# EasyEDA Pro project stm32可编程多功能手表 (1).epro

# Schematic Schematic1
Board Name: Board1; Create Date: 2025-06-26; Page Name: P1; Project Name: stm32可编程多功能手表; Schematic Name: Schematic1; Update Date: 2025-06-28; Company: 嘉立创EDA; Page Size: A4; Version: V1.0
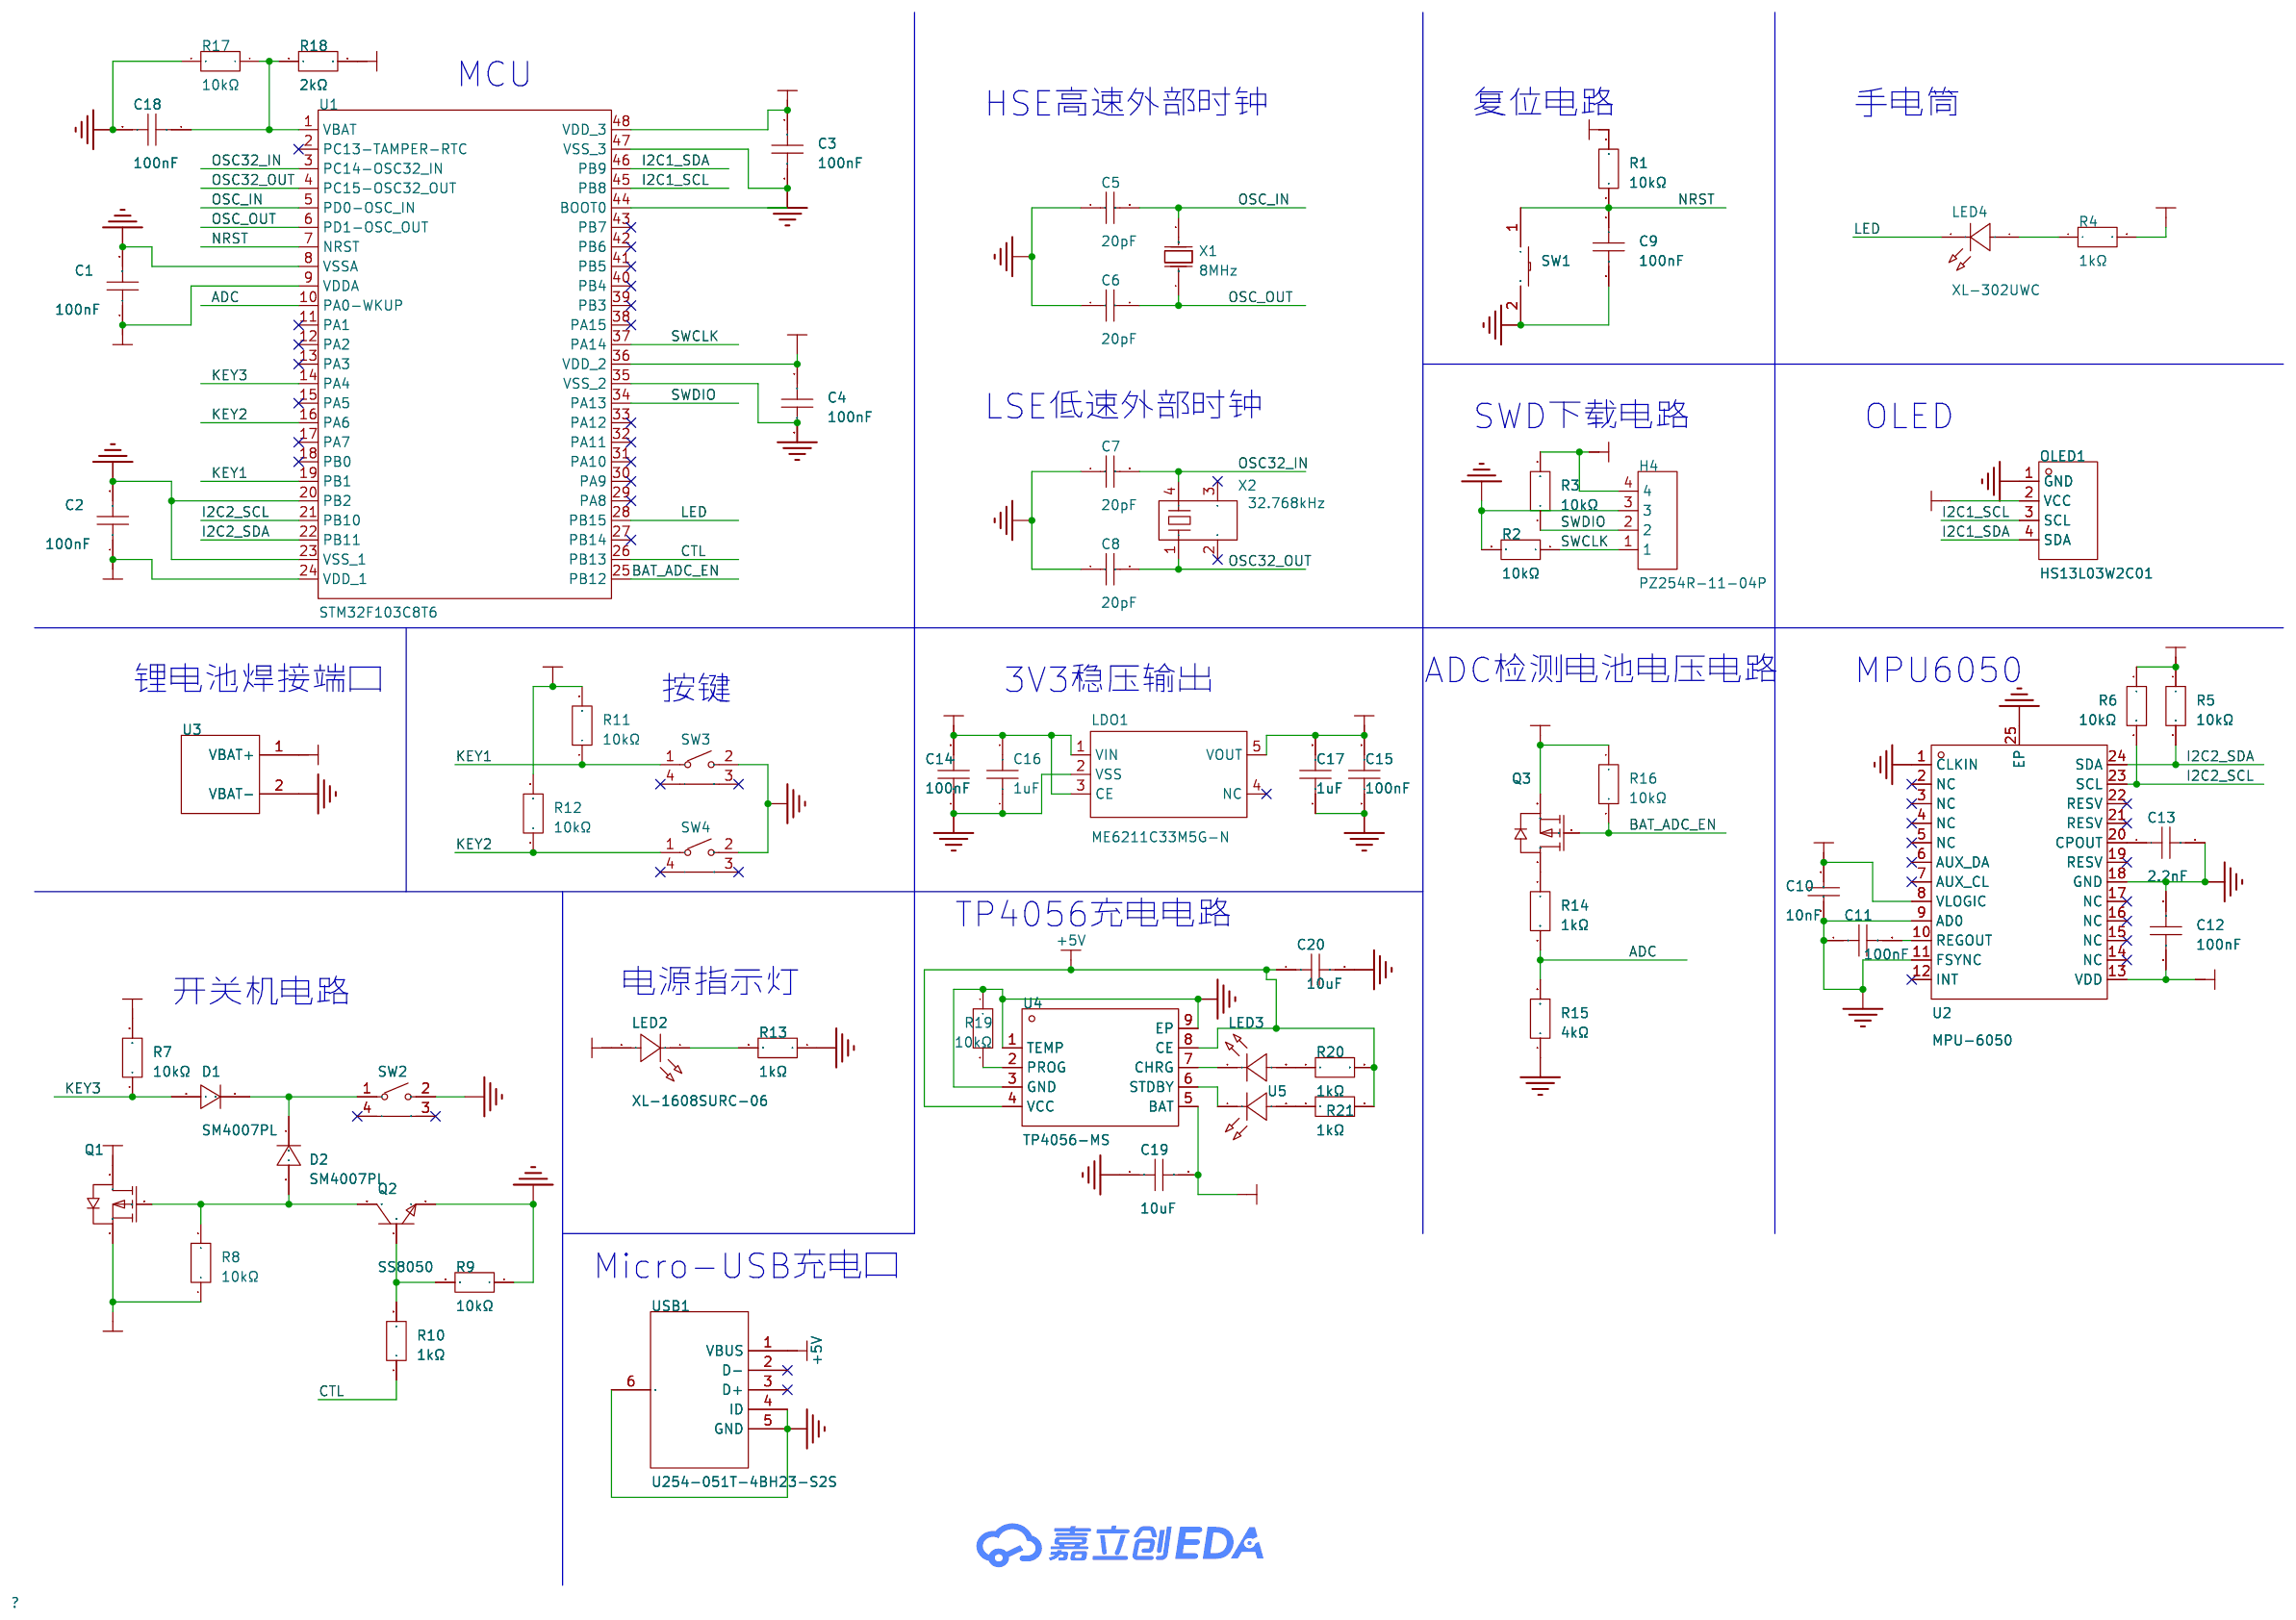
[diagram p0: schematic sheet]

## Parts
C1  100nF  [C0603]
C2  100nF  [C0603]
C3  100nF  [C0603]
C4  100nF  [C0603]
C5  20pF  [C0603]
C6  20pF  [C0603]
C7  20pF  [C0603]
C8  20pF  [C0603]
C9  100nF  [C0603]
C10  10nF  [C0603]
C11  100nF  [C0603]
C12  100nF  [C0603]
C13  2.2nF  [C0603]
C14  100nF  [C0603]
C15  100nF  [C0603]
C16  1uF  [C0603]
C17  1uF  [C0603]
C18  100nF  [C0603]
C19  10uF  [C0603]
C20  10uF  [C0603]
D1  SM4007PL  [SOD-123F_L2.8-W1.8-LS3.7-RD]
D2  SM4007PL  [SOD-123F_L2.8-W1.8-LS3.7-RD]
H4  PZ254R-11-04P  [HDR-TH_4P-P2.54-H-M-W10.4]
LDO1  ME6211C33M5G-N  [SOT-23-5_L3.0-W1.7-P0.95-LS2.8-BL]
LED2  XL-1608SURC-06  [LED0603-RD_RED]
LED3  XL-1608SURC-06  [LED0603-RD_RED]
LED4  XL-302UWC  [LED-TH_BD3.8-P2.54-FD_WHITE]
OLED1  HS13L03W2C01  [OLED-TH_L35.4-W33.5_HS13L03W2C01]
Q1  SI2301CDS-T1-GE3  [SOT-23-3_L3.0-W1.7-P0.95-LS2.9-BR]
Q2  SS8050  [SOT-23-3_L2.9-W1.3-P1.90-LS2.4-BR]
Q3  SI2301CDS-T1-GE3  [SOT-23-3_L3.0-W1.7-P0.95-LS2.9-BR]
R1  10kΩ  [R0603]
R2  10kΩ  [R0603]
R3  10kΩ  [R0603]
R4  1kΩ  [R0603]
R5  10kΩ  [R0603]
R6  10kΩ  [R0603]
R7  10kΩ  [R0603]
R8  10kΩ  [R0603]
R9  10kΩ  [R0603]
R10  1kΩ  [R0603]
R11  10kΩ  [R0603]
R12  10kΩ  [R0603]
R13  1kΩ  [R0603]
R14  1kΩ  [R0603]
R15  4kΩ  [R0603]
R16  10kΩ  [R0603]
R17  10kΩ  [R0603]
R18  2kΩ  [R0603]
R19  10kΩ  [R0603]
R20  1kΩ  [R0603]
R21  1kΩ  [R0603]
SW1  TS-1101-C-W  [SW-SMD_L6.0-W3.3-LS8.0]
SW2  GT-TC018A-H0375-L1  [SW-SMD_L4.7-W3.5-P3.35-EH]
SW3  GT-TC018A-H0375-L1  [SW-SMD_L4.7-W3.5-P3.35-EH]
SW4  GT-TC018A-H0375-L1  [SW-SMD_L4.7-W3.5-P3.35-EH]
U1  STM32F103C8T6  [LQFP-48_L7.0-W7.0-P0.50-LS9.0-BL]
U2  MPU-6050  [QFN-24_L4.0-W4.0-P0.50-BL-EP2.7]
U3  -  [302530BAT]
U4  TP4056-MS  [SOP-8_L4.9-W3.9-P1.27-LS6.0-TL-EP]
U5  XL-1608PGC-06  [LED0603-RD_GREEN]
USB1  U254-051T-4BH23-S2S  [MICRO-USB-SMD_U254-051T-4BH23-S2S]
X1  8MHz  [CRYSTAL-SMD_L5.0-W3.2]
X2  32.768kHz  [MC-306_4P-L8.0-W3.2-P5.5-BL]

## Library data of the parts
C1-C4 C9 C11 C12 C14 C15 C18 = CC0603KRX7R9BB104: 容值:100nF;精度:±10%;额定电压:50V;温度系数:X7R;; LCSC Part Name: 100nF ±10% 50V; Supplier Part: C14663; Manufacturer: YAGEO(国巨); Supplier Footprint: 0603; JLCPCB Part Class: 基础库; Datasheet: https://atta.szlcsc.com/upload/public/pdf/source/20180910/C282072_33301C7F631E79921B82A8DAC6BCC5B3.pdf; Supplier: LCSC; Tolerance: ±10%; Voltage Rating: 50V; Temperature Coefficient: X7R
C5-C8 = CL10C200JB8NNNC: 容值:20pF;精度:±5%;额定电压:50V;材质(温度系数):C0G;; LCSC Part Name: 20pF ±5% 50V; Supplier Part: C1648; Manufacturer: SAMSUNG(三星); Supplier Footprint: 0603; JLCPCB Part Class: 基础库; Datasheet: https://atta.szlcsc.com/upload/public/pdf/source/20160218/1457707763339.pdf; Supplier: LCSC; Tolerance: ±5%; Voltage Rated: 50V; Temperature Coefficient: C0G
C10 = CC0603KRX7R9BB103: 容值:10nF;精度:±10%;额定电压:50V;材质(温度系数):X7R;; LCSC Part Name: 10nF ±10% 50V; Supplier Part: C100042; Manufacturer: YAGEO(国巨); Supplier Footprint: 0603; JLCPCB Part Class: 扩展库; Datasheet: https://atta.szlcsc.com/upload/public/pdf/source/20181008/C309510_22F155564471FAF6A489F7D68F34234E.pdf; Supplier: LCSC; Tolerance: ±10%; Voltage Rated: 50V; Temperature Coefficient: X7R
C13 = FCC0603B222K500CT: 容值:2.2nF;精度:±10%;额定电压:50V;温度系数:X7R;; LCSC Part Name: 2.2nF ±10% 50V; Supplier Part: C5137562; Manufacturer: FOJAN(富捷); Supplier Footprint: 0603; JLCPCB Part Class: 扩展库; Datasheet: https://atta.szlcsc.com/upload/public/pdf/source/20220818/0EB3B7FB2F5648AC16609637FBA7DABE.pdf; Supplier: LCSC; Tolerance: ±10%; Voltage Rating: 50V; Temperature Coefficient: X7R
C16 C17 = CL10A105KB8NNNC: 容值:1uF;精度:±10%;额定电压:50V;材质(温度系数):X5R;; LCSC Part Name: 1uF ±10% 50V; Supplier Part: C15849; Manufacturer: SAMSUNG(三星); Supplier Footprint: 0603; JLCPCB Part Class: 基础库; Datasheet: https://atta.szlcsc.com/upload/public/pdf/source/20160218/1457707763339.pdf; Supplier: LCSC; Tolerance: ±10%; Voltage Rated: 50V; Temperature Coefficient: X5R
C19 C20 = CL10A106KP8NNNC: 容值:10uF;精度:±10%;额定电压:10V;材质(温度系数):X5R;; LCSC Part Name: 10uF ±10% 10V; Supplier Part: C19702; Manufacturer: SAMSUNG(三星); Supplier Footprint: 0603; JLCPCB Part Class: 基础库; Datasheet: https://atta.szlcsc.com/upload/public/pdf/source/20160218/1457707763339.pdf; Supplier: LCSC; Tolerance: ±10%; Voltage Rated: 10V; Temperature Coefficient: X5R
D1 D2 = SM4007PL_C64898: 二极管配置:独立式;正向压降(Vf):1.1V@1A;直流反向耐压(Vr):1kV;整流电流:1A;; Supplier Part: C64898; Manufacturer: MDD(辰达半导体); Supplier Footprint: SOD-123FL; JLCPCB Part Class: 基础库; Datasheet: https://atta.szlcsc.com/upload/public/pdf/source/20241121/400BA5297D1B92A42708AD93AB64CE21.pdf; Supplier: LCSC; Diode Configuration: 独立式; Voltage - Forward(Vf@If): 1.1V@1A; Voltage - DC Reverse(Vr): 1kV; Current - Rectified: 1A; Reverse Leakage Current (Ir): 10uA@1kV
H4 = PZ254R-11-04P: 插针结构:1x4P;间距:2.54mm;行距:-;圆针/方针:方针;安装方式:弯插;排数:单排;总PIN位数:4P;额定电流:-;额定电压:-;配合针长度:6mm;塑高:2.5mm;触头材质:黄铜;触头镀层:-;工作温度:-40℃~+105℃;颜色:黑色;; LCSC Part Name: 1x4P 间距:2.54mm 方针 弯插; Supplier Part: C492412; Manufacturer: XFCN(兴飞); Supplier Footprint: 弯插,P=2.54mm; JLCPCB Part Class: 扩展库; Datasheet: https://atta.szlcsc.com/upload/public/pdf/source/20200309/C492412_B0EFFC1946AB079B8871416C4A09EF6C.pdf; Supplier: LCSC; Pin Structure: 1x4P; Pitch: 2.54mm; Circluar Pins/Square Pins: 方针; Mounting Type: 弯插; Number of Rows: 单排; Number of Pins: 4P; Length of Mating Pin: 6mm; Insulation Height: 2.5mm; Contact Material: 黄铜; Operating Temperature: -40℃~+105℃; Color: 黑色
LDO1 = ME6211C33M5G-N: 输出类型:固定;工作电压:6V;输出电压:3.3V;输出电流:500mA;电源纹波抑制比(PSRR):70dB@(1kHz)；62dB@(10kHz);输出极性:正极;; LCSC Part Name: 输入6V 输出3.3V 500mA; Supplier Part: C82942; Manufacturer: MICRONE(南京微盟); Supplier Footprint: SOT-23-5; JLCPCB Part Class: 扩展库; Datasheet: https://atta.szlcsc.com/upload/public/pdf/source/20170918/C82942_1505727073070976520.pdf; Supplier: LCSC; Output Type: 固定; Voltage - Supply: 6V; Output Voltage: 3.3V; Output Current: 500mA; Power Supply Rejection Ratio (PSRR): 70dB@(1kHz)；62dB@(10kHz); Voltage Dropout: 260mV@(200mA); Features: 短路保护(SCP)；低ESR；过流保护(OCP)；带使能; Output Configuration: 正极; Number of Outputs: 1
LED2 LED3 = XL-1608SURC-06: 灯头类型:-;发光颜色:红色;正向压降(Vf):2.3V;功率:50mW;正向电流:20mA;波长:620nm~630nm;二极管配置:-;透镜颜色:无色透明透镜;色温:-;发光强度:225mcd;发光角度:120°;载带方式:正贴;工作温度:-20℃~+85℃;; Supplier Part: C965799; Manufacturer: XINGLIGHT(成兴光); Supplier Footprint: 0603; JLCPCB Part Class: 扩展库; Datasheet: https://atta.szlcsc.com/upload/public/pdf/source/20250213/F9766CE804AF391355DCDD48DB3E0DAB.pdf; Supplier: LCSC; Illumination Color: 红色; Voltage - Forward(Vf): 2.3V; Power(Watts): 50mW; Forward Current: 20mA; Wavelength - Dominant: 620nm~630nm; Peak Wavelength: 625nm; Lens Color: 无色透明透镜; Luminous Intensity: 225mcd; Viewing Angle: 120°; Mounting Sytle: 正贴; Operating Temperature: -20℃~+85℃
LED4 = XL-302UWC: 灯头类型:3mm圆形灯头;发光颜色:白色;正向压降(Vf):3.2V;功率:70mW;正向电流:20mA;透镜颜色:无色透明透镜;色温:6000K~8000K;发光强度:8000mcd;发光角度:30°;载带方式:-;工作温度:-20℃~+85℃;; Supplier Part: C2895458; Manufacturer: XINGLIGHT(成兴光); Supplier Footprint: 插件,D=3mm; JLCPCB Part Class: 扩展库; Datasheet: https://atta.szlcsc.com/upload/public/pdf/source/20240112/543BCCAC3CB93518E6AD22EB07A95060.pdf; Supplier: LCSC; Lamp Holder Type: 3mm圆形灯头; Illumination Color: 白色; Voltage - Forward(Vf): 3.2V; Power(Watts): 70mW; Forward Current: 20mA; Lens Color: 无色透明透镜; Color Temperature: 6000K~8000K; Luminous Intensity: 8000mcd; Viewing Angle: 30°; Operating Temperature: -20℃~+85℃
OLED1 = HS13L03W2C01: 主控芯片:SH1106;接口类型:I2C;尺寸(inch):1.3;; LCSC Part Name: 1.3'1.3寸 128*64 OLED显示屏 I2C通讯 SH1106 白光; Supplier Part: C7465997; Manufacturer: HS(汉昇); JLCPCB Part Class: 扩展库; Datasheet: https://atta.szlcsc.com/upload/public/pdf/source/20230720/8731A47396DED074CDCD72E9ACEFB46F.pdf; Supplier: LCSC; Main Control Chip: SH1106; Interface Type: I2C; Size: 1.3; Operating Temperature: -40℃~+70℃
Q1 Q3 = SI2301CDS-T1-GE3: 数量:1个P沟道;漏源电压(Vdss):20V;连续漏极电流(Id):2.3A;导通电阻(RDS(on)):112mΩ@4.5V,2.8A;耗散功率(Pd):860mW;阈值电压(Vgs(th)):1V;; LCSC Part Name: 1个P沟道 耐压:20V 电流:2.3A; Supplier Part: C10487; Manufacturer: VISHAY(威世); Supplier Footprint: SOT-23; JLCPCB Part Class: 基础库; Datasheet: https://atta.szlcsc.com/upload/public/pdf/source/20180621/C10487_757133A2CC00440C4C7DD3E7E73681E9.pdf; Supplier: LCSC; Number: 1个P沟道; Drain to Source Voltage: 20V; Current - Continuous Drain(Id): 2.3A; RDS(on): 112mΩ@4.5V,2.8A; Pd - Power Dissipation: 860mW; Gate Threshold Voltage (Vgs(th)@Id): 1V; Gate Charge(Qg): 3.3nC@10V; Input Capacitance(Ciss@Vds): 405pF@10V; Reverse Transfer Capacitance (Crss@Vds): 55pF@10V; Operating Temperature: -55℃~+150℃
Q2 = SS8050_C7420370: 晶体管类型:NPN;集电极电流(Ic):1.5A;集射极击穿电压(Vceo):25V;耗散功率(Pd):300mW;直流电流增益(hFE):120@100mA,1.0V;; LCSC Part Name: H档 200-350; Supplier Part: C7420370; Manufacturer: 宏嘉诚; Supplier Footprint: SOT-23; Datasheet: https://atta.szlcsc.com/upload/public/pdf/source/20250205/5DB94E86981B5B1A1866D18E379C0D4F.pdf; Supplier: LCSC; type: NPN; Current - Collector(Ic): 1.5A; Collector - Emitter Voltage VCEO: 25V; Pd - Power Dissipation: 300mW; DC Current Gain: 120@100mA,1.0V; Transition frequency(fT): 100MHz; Current - Collector Cutoff: 100nA; Vce Saturation(VCE(sat)): 500mV; Operating Temperature: -55℃~+150℃
R1-R3 R5-R9 R11 R12 R16 R17 R19 = FRC0603J103 TS: 电阻类型:厚膜电阻;阻值:10kΩ;精度:±5%;功率:100mW;工作电压:75V;温度系数:±100ppm/℃;; LCSC Part Name: 10kΩ ±5% 100mW 厚膜电阻; Supplier Part: C2930027; Manufacturer: FOJAN(富捷); Supplier Footprint: 0603; JLCPCB Part Class: 扩展库; Datasheet: https://atta.szlcsc.com/upload/public/pdf/source/20211221/925EC7D7225764EE0046F22065062C87.pdf; Supplier: LCSC; Type: 厚膜电阻; Tolerance: ±5%; Power(Watts): 100mW; Voltage-Supply(Max): 75V; Temperature Coefficient: ±100ppm/℃; Operating Temperature: -55℃~+155℃
R4 R10 R13 R14 R20 R21 = FRC0603F1001TS: 电阻类型:厚膜电阻;阻值:1kΩ;精度:±1%;功率:100mW;最大工作电压:75V;温度系数:±100ppm/℃;; LCSC Part Name: 1kΩ ±1% 100mW 厚膜电阻; Supplier Part: C2907002; Manufacturer: FOJAN(富捷); Supplier Footprint: 0603; JLCPCB Part Class: 扩展库; Datasheet: https://atta.szlcsc.com/upload/public/pdf/source/20211221/925EC7D7225764EE0046F22065062C87.pdf; Supplier: LCSC; Type: 厚膜电阻; Tolerance: ±1%; Power(Watts): 100mW; Overload Voltage (Max): 75V; Temperature Coefficient: ±100ppm/℃; Operating Temperature Range: -55℃~+155℃
R15 = ARG03FTC4001N: 电阻类型:薄膜电阻;阻值:4kΩ;精度:±1%;; LCSC Part Name: 4kΩ ±1%; Supplier Part: C2984443; Manufacturer: Viking(光颉); Supplier Footprint: 0603; JLCPCB Part Class: 扩展库; Datasheet: https://atta.szlcsc.com/upload/public/pdf/source/20200117/C485675_99063924B4564AF910B7BE66DA8EFA49.pdf; Supplier: LCSC; Type: 薄膜电阻; Tolerance: ±1%
R18 = FRC0603J202 TS: 电阻类型:厚膜电阻;阻值:2kΩ;精度:±5%;功率:100mW;最大工作电压:75V;温度系数:±100ppm/℃;; LCSC Part Name: 2kΩ ±5% 100mW 厚膜电阻; Supplier Part: C2907137; Manufacturer: FOJAN(富捷); Supplier Footprint: 0603; Datasheet: https://atta.szlcsc.com/upload/public/pdf/source/20211221/925EC7D7225764EE0046F22065062C87.pdf; Supplier: LCSC; Type: 厚膜电阻; Tolerance: ±5%; Power(Watts): 100mW; Overload Voltage (Max): 75V; Temperature Coefficient: ±100ppm/℃; Operating Temperature Range: -55℃~+155℃
SW1 = TS-1101-C-W: 电路结构:单刀单掷;按钮形状:矩形按钮;作用力:260gf;安装方式:立贴;开关长度:6mm;开关宽度:3.6mm;开关高度:2.5mm;带支架:不带;触点电流:50mA;额定电压(AC):-;额定电压(DC):12V;额定功率:-;绝缘电阻:-;带灯:无;机械寿命:5万次;; LCSC Part Name: 6*3.6*2.5mm 立贴 轻触开关; Supplier Part: C318938; Manufacturer: XKB Connectivity(中国星坤); Supplier Footprint: SMD; JLCPCB Part Class: 扩展库; Datasheet: https://atta.szlcsc.com/upload/public/pdf/source/20200227/C318938_C2E53B1EEDE37D980A33616AC086DE53.pdf; Supplier: LCSC; Circuit: 单刀单掷; Actuator Style: 矩形按钮; Operating Force: 260gf; Mounting Style: 立贴; Switch Length: 6mm; Switch Width: 3.6mm; Switch Height: 2.5mm; Strike Gundam: 不带; Contact Current: 50mA; Voltage Rating (DC): 12V; Actuator/Cap Color: 白色带淡绿; With Lamp: 无; Mechanical Life: 5万次; Operating Temperature: -30℃~+85℃
SW2-SW4 = GT-TC018A-H0375-L1: 电路结构:单刀单掷;按钮形状:矩形按钮;作用力:1.6N;安装方式:卧贴;开关长度:4.7mm;开关宽度:1.9mm;开关高度:3.75mm;带支架:不带;触点电流:50mA;额定电压(DC):12V;绝缘电阻:100MΩ;带灯:无;机械寿命:10万次;; LCSC Part Name: 4.7*1.9*3.75mm 卧贴 轻触开关; Supplier Part: C963235; Manufacturer: G-Switch(品赞); Supplier Footprint: SMD; Datasheet: https://atta.szlcsc.com/upload/public/pdf/source/20201201/C963235_1379E8FB9A9D5A830B16F6A18B8D18DC.pdf; Supplier: LCSC; Circuit: 单刀单掷; Actuator Style: 矩形按钮; Operating Force: 1.6N; Mounting Style: 卧贴; Switch Length: 4.7mm; Switch Width: 1.9mm; Switch Height: 3.75mm; Strike Gundam: 不带; Contact Current: 50mA; Voltage Rating (DC): 12V; Insulation Resistance: 100MΩ; Actuator/Cap Color: 黑色; With Lamp: 无; Pin Style: SMD接片; Mechanical Life: 10万次; Operating Temperature: -30℃~+85℃
U1 = STM32F103C8T6: CPU内核:ARM-M3;CPU最大主频:72MHz;应用领域:-;; LCSC Part Name: 主流增强型ARM Cortex-M3 MCU，具有64 KB Flash、72 MHz CPU、电机控制、USB和CAN; Supplier Part: C8734; Manufacturer: ST(意法半导体); Supplier Footprint: LQFP-48(7x7); JLCPCB Part Class: 扩展库; Datasheet: https://atta.szlcsc.com/upload/public/pdf/source/20220812/8363ACEC51AD55ECEB84799464F7CB85.pdf; Supplier: LCSC; CPU Core: ARM-M3; CPU Maximum Speed: 72MHz; Program Storage Size: 64KB; Program Memory Type: FLASH; Number of I/O: 37; ADC (Bit): 12bit; Voltage - Supply: 2V~3.6V
U2 = MPU-6050: 传感器类型:加速度计陀螺仪;; Supplier Part: C24112; Manufacturer: TDK InvenSense(应美盛); Supplier Footprint: QFN-24-EP(4x4); JLCPCB Part Class: 扩展库; Datasheet: https://atta.szlcsc.com/upload/public/pdf/source/20140425/1457707046159.pdf; Supplier: LCSC; Sensor Type: 加速度计陀螺仪; Operating Temperature: -40℃~+85℃
U3 = 302530BAT
U4 = TP4056-MS: 电源电压:4.2V~9V;最大充电电流:1A;电池类型:锂离子/聚合物;电池节数:1;; Supplier Part: C7473158; Manufacturer: MSKSEMI(美森科); Supplier Footprint: SOP-8-EP; JLCPCB Part Class: 扩展库; Datasheet: https://atta.szlcsc.com/upload/public/pdf/source/20230808/7F9175670C53D6763A7A5691214AEA38.pdf; Supplier: LCSC; Supply Voltage: 4.2V~9V; Maximum Charge Current: 1A; Type of Battery: 锂离子/聚合物; Number of Cells: 1; Operating Temperature: -40℃~+85℃
U5 = XL-1608PGC-06: 灯头类型:-;发光颜色:翠绿色;正向电压(VF):2.6V~3V;功率:75mW;正向电流:5mA;主波长:505nm~540nm;二极管配置:-;透镜颜色:绿色透镜;色温:-;发光强度:299mcd;发光角度:130°;载带方式:正贴;工作温度:-;; Supplier Part: C7371905; Manufacturer: XINGLIGHT(成兴光); Supplier Footprint: 0603; JLCPCB Part Class: 扩展库; Datasheet: https://atta.szlcsc.com/upload/public/pdf/source/20240218/2F8A7AF596DEEB38157DAB7856E382C0.pdf; Supplier: LCSC; Emitted Color: 翠绿色; Forward Voltage (VF): 2.6V~3V; Power Dissipation: 75mW; Forward Current: 5mA; Dominant Wavelength: 505nm~540nm; Peak Wavelength: 530nm; Lens Color: 绿色透镜; Luminous Intensity: 299mcd; Viewing Angle: 130°; Mounting Sytle: 正贴
USB1 = U254-051T-4BH23-S2S: 连接器类型:Micro-B;标准:-;公母:母;安装方式:-;触点数量:5P;端口数量:1;额定电流 - 电源:1.8A;触头材质:铜合金;触头镀层:金;工作温度范围:-40℃~+85℃;焊接温度(最大值):260℃;; LCSC Part Name: Micro-B 母; Supplier Part: C482361; Manufacturer: XKB Connection(中国星坤); Supplier Footprint: SMD; JLCPCB Part Class: 扩展库; Datasheet: https://atta.szlcsc.com/upload/public/pdf/source/20211011/BAA279962023C91D65D7E291D0BA8E57.pdf; Supplier: LCSC; Connector Type: Micro-B; Gender: 母; Number of Contacts: 5P; Number of Ports: 1; Current Rating - Power (Max): 1.8A; Contact Material: 铜合金; Contact Plating: 金; Operating Temperature Range: -40℃~+85℃; Soldering Temperature(Max): 260℃
X1 = X50328MSB2GI: 晶振类型:贴片晶振;频率:8MHz;常温频差:±10ppm;负载电容:20pF;频率稳定度:±20ppm;; LCSC Part Name: YSX530GA 8MHZ 2P 5032 20PF ±10PPM -40~85℃ (±20PPM); Supplier Part: C115962; Manufacturer: YXC(扬兴晶振); Supplier Footprint: SMD5032; JLCPCB Part Class: 基础库; Datasheet: https://atta.szlcsc.com/upload/public/pdf/source/20240329/44922B0AF7B60E58E9B66993B6077277.pdf; Supplier: LCSC; Type: 贴片晶振; Normal temperature Frequency Tolerance: ±10ppm; Load Capacitance: 20pF; Frequency Stability: ±20ppm; Operating Temperature: -40℃~+85℃
X2 = Q13MC30610003: 晶振类型:贴片晶振;频率:32.768kHz;常温频差:±20ppm;负载电容:12.5pF;; LCSC Part Name: 32.768kHz ±20ppm 12.5pF; Supplier Part: C16320; Manufacturer: EPSON(爱普生); Supplier Footprint: MC-306; JLCPCB Part Class: 扩展库; Datasheet: https://atta.szlcsc.com/upload/public/pdf/source/20161110/1478747315604.pdf; Supplier: LCSC; Type: 贴片晶振; Normal temperature Frequency Tolerance: ±20ppm; Load Capacitance: 12.5pF; Equivalent Series Resistance(ESR): 35kΩ; Operating Temperature: -40℃~+85℃

## Nets
3V3: C1.1 C2.1 C3.1 C4.1 C10.2 C12.1 C15.2 C17.2 H4.4 LDO1.5(VOUT) LED2.2(A) OLED1.2(VCC) R1.2 R3.2 R4.2 R5.1 R6.1 R7.2 R11.2 R12.2 U1.9(VDDA) U1.24(VDD_1) U1.36(VDD_2) U1.48(VDD_3) U2.8(VLOGIC) U2.13(VDD)
+5V: C20.1 R20.2 R21.2 U4.4(VCC) U4.8(CE) USB1.1(VBUS)
GND: C1.2 C2.2 C3.2 C4.2 C5.1 C6.1 C7.1 C8.1 C9.2 C10.1 C11.1 C12.2 C13.2 C14.1 C15.1 C16.1 C17.1 C18.2 C19.1 C20.2 H4.3 LDO1.2(VSS) OLED1.1(GND) Q2.2(E) R2.2 R9.1 R13.1 R15.1 R17.2 R19.1 SW1.2 SW2.2 SW3.2 SW4.2 U1.8(VSSA) U1.20(PB2) U1.23(VSS_1) U1.35(VSS_2) U1.44(BOOT0) U1.47(VSS_3) U2.1(CLKIN) U2.9(AD0) U2.11(FSYNC) U2.18(GND) U2.25(EP) U3.2(VBAT-) U4.1(TEMP) U4.3(GND) U4.9(EP) USB1.4(ID) USB1.5(GND) USB1.6(EH)
VBAT: C14.2 C16.2 LDO1.1(VIN) LDO1.3(CE) Q1.3(D)
VBAT+: C19.2 Q1.2(S) Q3.2(S) R8.1 R16.1 R18.2 U3.1(VBAT+) U4.5(BAT)
ADC: R14.2 R15.2 U1.10(PA0-WKUP)
BAT_ADC_EN: Q3.1(G) R16.2 U1.25(PB12)
CTL: R10.1 U1.26(PB13)
I2C1_SCL: OLED1.3(SCL) U1.45(PB8)
I2C1_SDA: OLED1.4(SDA) U1.46(PB9)
I2C2_SCL: R6.2 U1.21(PB10) U2.23(SCL)
I2C2_SDA: R5.2 U1.22(PB11) U2.24(SDA)
KEY1: R11.1 SW3.1 U1.19(PB1)
KEY2: R12.1 SW4.1 U1.16(PA6)
KEY3: D1.2(A) R7.1 U1.14(PA4)
LED: LED4.2(K) U1.28(PB15)
NRST: C9.1 R1.1 SW1.1 U1.7(NRST)
OSC32_IN: C7.2 U1.3(PC14-OSC32_IN) X2.4
OSC32_OUT: C8.2 U1.4(PC15-OSC32_OUT) X2.1
OSC_IN: C5.2 U1.5(PD0-OSC_IN) X1.2(OSC2)
OSC_OUT: C6.2 U1.6(PD1-OSC_OUT) X1.1(OSC1)
SWCLK: H4.1 R2.1 U1.37(PA14)
SWDIO: H4.2 R3.1 U1.34(PA13)
$1N2127: LED4.1(A) R4.1
$1N2723: C11.2 U2.10(REGOUT)
$1N2897: C13.1 U2.20(CPOUT)
$1N4359: D1.1(C) D2.1(C) SW2.1
$1N4372: D2.2(A) Q1.1(G) Q2.3(C) R8.2
$1N4677: Q2.1(B) R9.2 R10.2
$1N5591: LED2.1(K) R13.2
$1N5674: Q3.3(D) R14.1
$1N5975: C18.1 R17.1 R18.1 U1.1(VBAT)
$1N6421: R19.2 U4.2(PROG)
$1N6590: LED3.1(K) U4.7(CHRG)
$1N6593: LED3.2(A) R20.1
$1N6685: R21.1 U5.2(A)
$1N6689: U4.6(STDBY) U5.1(K)

Not connected (* = marked no-connect by the designer): LDO1 4(NC)*; SW2 3* 4*; SW3 3* 4*; SW4 3* 4*; U1 2(PC13-TAMPER-RTC)* 11(PA1)* 12(PA2)* 13(PA3)* 15(PA5)* 17(PA7)* 18(PB0)* 27(PB14)* 29(PA8)* 30(PA9)* 31(PA10)* 32(PA11)* 33(PA12)* 38(PA15)* 39(PB3)* 40(PB4)* 41(PB5)* 42(PB6)* 43(PB7)*; U2 2(NC)* 3(NC)* 4(NC)* 5(NC)* 6(AUX_DA)* 7(AUX_CL)* 12(INT)* 14(NC)* 15(NC)* 16(NC)* 17(NC)* 19(RESV)* 21(RESV)* 22(RESV)*; USB1 2(D-)* 3(D+)*; X2 2* 3*

## Notes on the sheet
- MCU
- HSE高速外部时钟
- 复位电路
- 手电筒
- LSE低速外部时钟
- SWD下载电路
- OLED
- ADC检测电池电压电路
- MPU6050
- 锂电池焊接端口
- 按键
- 3V3稳压输出
- TP4056充电电路
- 开关机电路
- 电源指示灯
- Micro-USB充电口

# Board PCB1
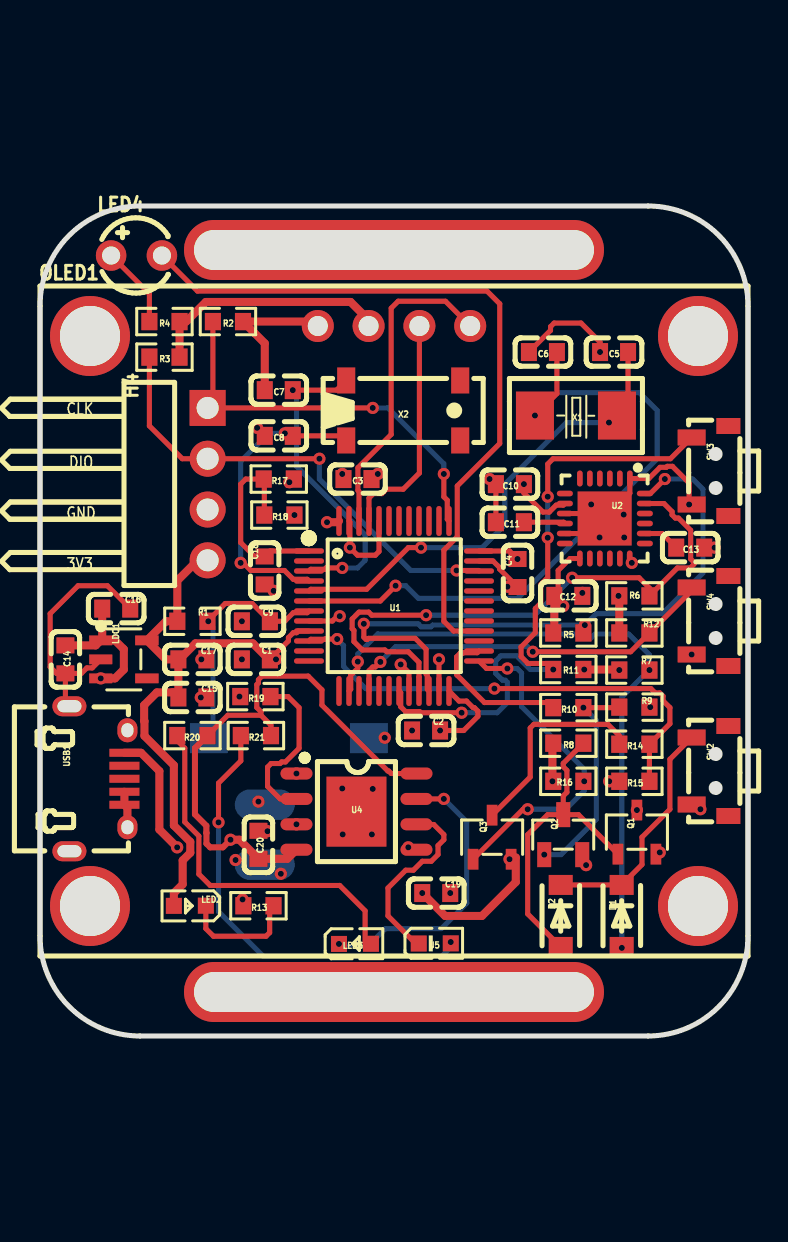
[diagram p1: board, top side]
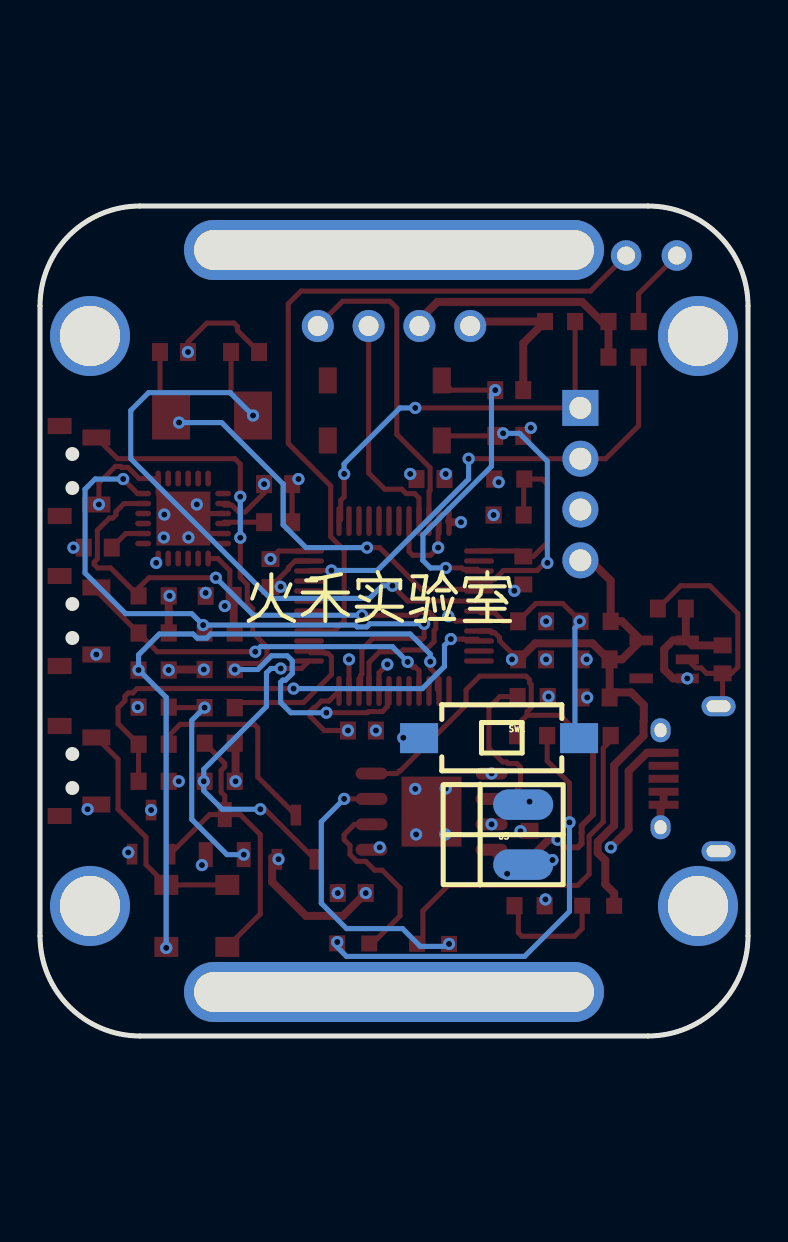
[diagram p2: board, bottom side, seen from below]

Outline 35.4 x 41.5 mm; copper layers: Top Layer, GND, PWR, Bottom Layer. Coordinates in mm from the lower left corner of the outline.
Outline path: 0,36.5 0,5 arc(1.46,1.46) 5,0 30.4,0 arc(33.94,1.46) 35.4,5 35.4,36.5 arc(33.94,40.04) 30.4,41.5 5,41.5 arc(1.46,40.04) 0,36.5
Stack: Top Layer 0.035mm 外层铜厚1oz / Dielectric1 0.2104mm 7628 RC49% 8.6mil / GND 0.0152mm 内层铜厚 / Dielectric2 1.065mm 1.1mm H/HOZ Copper / PWR 0.0152mm 内层铜厚 / Dielectric3 0.2104mm 7628 RC49% 8.6mil / Bottom Layer 0.035mm 外层铜厚1oz

## Design rules (mm)
template: JLCPCB Capability(Two Layers Board)
spacing copperThickness1oz (default): track to track 0.102, other pairs 0.152 to 0.3
spacing copperThickness2oz: track to track 0.203, other pairs 0.152 to 0.3
track width copperThickness1oz (default): min 0.127, default 0.254, max 2.54
track width copperThickness2oz: min 0.203, default 0.254, max 2.54
differential pair differentialPair (default): width min 0.127, default 0.254, max 2.54; gap min 0.152, default 0.152
via viaSize (default): diameter min 0.5, default 0.61, max 10; hole min 0.3, default 0.305, max 6.3

## Placement (name value [footprint] x y rotation side)
C1  100nF  [C0603]  10.79 18.83 180 top
C2  100nF  [C0603]  19.3 15.28 180 top
C3  100nF  [C0603]  15.88 27.85 0 top
C4  100nF  [C0603]  23.88 23.15 270 top
C5  20pF  [C0603]  28.7 34.2 0 top
C6  20pF  [C0603]  25.15 34.2 0 top
C7  20pF  [C0603]  11.94 32.29 0 top
C8  20pF  [C0603]  11.94 30.01 0 top
C9  100nF  [C0603]  10.79 20.74 180 top
C10  10nF  [C0603]  23.5 27.59 0 top
C11  100nF  [C0603]  23.5 25.69 0 top
C12  100nF  [C0603]  26.42 22.01 0 top
C13  2.2nF  [C0603]  32.51 24.42 0 top
C14  100nF  [C0603]  1.27 18.83 90 top
C15  100nF  [C0603]  7.62 16.93 180 top
C16  1uF  [C0603]  3.81 21.37 180 top
C17  1uF  [C0603]  7.62 18.83 180 top
C18  100nF  [C0603]  11.23 23.28 270 top
C19  10uF  [C0603]  19.81 7.15 180 top
C20  10uF  [C0603]  10.92 9.56 90 top
D1  SM4007PL  [SOD-123F_L2.8-W1.8-LS3.7-RD]  29.08 6 270 top
D2  SM4007PL  [SOD-123F_L2.8-W1.8-LS3.7-RD]  26.03 6 270 top
H4  PZ254R-11-04P  [HDR-TH_4P-P2.54-H-M-W10.4]  8.38 27.59 270 top
LDO1  ME6211C33M5G-N  [SOT-23-5_L3.0-W1.7-P0.95-LS2.8-BL]  4.19 18.83 270 top
LED2  XL-1608SURC-06  [LED0603-RD_RED]  7.49 6.51 180 top
LED3  XL-1608SURC-06  [LED0603-RD_RED]  15.75 4.61 0 top
LED4  XL-302UWC  [LED-TH_BD3.8-P2.54-FD_WHITE]  4.83 39.02 0 top
NOREF  -  [Pad_e70]  17.7 39.3 0 top
NOREF#2  -  [Pad_e65]  2.5 35 0 top
NOREF#3  -  [Pad_e67]  32.9 35 0 top
NOREF#4  -  [Pad_e68]  2.5 6.5 0 top
NOREF#5  -  [Pad_e72]  17.7 2.2 0 top
NOREF#6  -  [Pad_e69]  32.9 6.5 0 top
OLED1  HS13L03W2C01  [OLED-TH_L35.4-W33.5_HS13L03W2C01]  17.7 35.5 0 top
Q1  SI2301CDS-T1-GE3  [SOT-23-3_L3.0-W1.7-P0.95-LS2.9-BR]  29.84 10.19 270 top
Q2  SS8050  [SOT-23-3_L2.9-W1.3-P1.90-LS2.4-BR]  26.16 10.07 270 top
Q3  SI2301CDS-T1-GE3  [SOT-23-3_L3.0-W1.7-P0.95-LS2.9-BR]  22.61 9.94 270 top
R1  10kΩ  [R0603]  7.62 20.74 180 top
R2  10kΩ  [R0603]  9.4 35.72 0 top
R3  10kΩ  [R0603]  6.22 33.94 0 top
R4  1kΩ  [R0603]  6.22 35.72 0 top
R5  10kΩ  [R0603]  26.42 20.15 0 top
R6  10kΩ  [R0603]  29.72 22.01 0 top
R7  10kΩ  [R0603]  29.72 18.3 180 top
R8  10kΩ  [R0603]  26.42 14.64 0 top
R9  10kΩ  [R0603]  29.72 16.44 180 top
R10  1kΩ  [R0603]  26.42 16.42 0 top
R11  10kΩ  [R0603]  26.42 18.32 0 top
R12  10kΩ  [R0603]  29.72 20.15 180 top
R13  1kΩ  [R0603]  10.92 6.51 0 top
R14  1kΩ  [R0603]  29.72 14.59 0 top
R15  4kΩ  [R0603]  29.72 12.73 0 top
R16  10kΩ  [R0603]  26.42 12.73 0 top
R17  10kΩ  [R0603]  11.94 27.85 0 top
R18  2kΩ  [R0603]  11.97 26.05 0 top
R19  10kΩ  [R0603]  10.77 16.97 0 top
R20  1kΩ  [R0603]  7.62 15.02 0 top
R21  1kΩ  [R0603]  10.79 15.02 0 top
SW1  TS-1101-C-W  [SW-SMD_L6.0-W3.3-LS8.0]  12.45 14.89 0 bottom
SW2  GT-TC018A-H0375-L1  [SW-SMD_L4.7-W3.5-P3.35-EH]  33.5 13.25 270 top
SW3  GT-TC018A-H0375-L1  [SW-SMD_L4.7-W3.5-P3.35-EH]  33.5 28.25 270 top
SW4  GT-TC018A-H0375-L1  [SW-SMD_L4.7-W3.5-P3.35-EH]  33.5 20.75 270 top
U1  STM32F103C8T6  [LQFP-48_L7.0-W7.0-P0.50-LS9.0-BL]  17.7 21.5 270 top
U2  MPU-6050  [QFN-24_L4.0-W4.0-P0.50-BL-EP2.7]  28.24 25.87 180 top
U3  -  [302530BAT]  15.24 10.07 180 bottom
U4  TP4056-MS  [SOP-8_L4.9-W3.9-P1.27-LS6.0-TL-EP]  15.82 11.22 0 top
U5  XL-1608PGC-06  [LED0603-RD_GREEN]  19.74 4.63 0 top
USB1  U254-051T-4BH23-S2S  [MICRO-USB-SMD_U254-051T-4BH23-S2S]  2.92 12.86 270 top
X1  8MHz  [CRYSTAL-SMD_L5.0-W3.2]  26.8 31.02 0 top
X2  32.768kHz  [MC-306_4P-L8.0-W3.2-P5.5-BL]  18.16 31.28 0 top

## Footprints (pads in the part's own frame, mm; a bottom-side part is the same pattern mirrored in y, then rotated)
302530BAT
  oval 3x1.524 smd: 1(4,1.5) 2(4,-1.5)
C0603
  rect 0.8x0.9 smd: 1(-0.7,0) 2(0.7,0)
CRYSTAL-SMD_L5.0-W3.2
  rect 1.9x2.4 smd: 1(-2.05,0) 2(2.05,0)
HDR-TH_4P-P2.54-H-M-W10.4
  rect 1.8x1.8 hole 1.1: 1(-3.81,0)
  round 1.8 hole 1.1: 2(-1.27,0) 3(1.27,0) 4(3.81,0)
LED0603-RD_GREEN
  rect 0.8x0.8 smd: 1(-0.799,-0.004) 2(0.799,0.004)
LED0603-RD_RED
  rect 0.8x0.8 smd: 1(-0.799,-0.004) 2(0.799,0.004)
LED-TH_BD3.8-P2.54-FD_WHITE
  round 1.524 hole 0.9: 1(-1.27,0) 2(1.27,0)
LQFP-48_L7.0-W7.0-P0.50-LS9.0-BL
  oval 0.27x1.5 smd: 1(-2.75,-4.25) 2(-2.25,-4.25) 3(-1.75,-4.25) 4(-1.25,-4.25) 5(-0.75,-4.25) 6(-0.25,-4.25) 7(0.25,-4.25) 8(0.75,-4.25) 9(1.25,-4.25) 10(1.75,-4.25) 11(2.25,-4.25) 12(2.75,-4.25) 25(2.75,4.25) 26(2.25,4.25) 27(1.75,4.25) 28(1.25,4.25) 29(0.75,4.25) 30(0.25,4.25) 31(-0.25,4.25) 32(-0.75,4.25) 33(-1.25,4.25) 34(-1.75,4.25) 35(-2.25,4.25) 36(-2.75,4.25)
  oval 1.5x0.27 smd: 13(4.25,-2.75) 14(4.25,-2.25) 15(4.25,-1.75) 16(4.25,-1.25) 17(4.25,-0.75) 18(4.25,-0.25) 19(4.25,0.25) 20(4.25,0.75) 21(4.25,1.25) 22(4.25,1.75) 23(4.25,2.25) 24(4.25,2.75) 37(-4.25,2.75) 38(-4.25,2.25) 39(-4.25,1.75) 40(-4.25,1.25) 41(-4.25,0.75) 42(-4.25,0.25) 43(-4.25,-0.25) 44(-4.25,-0.75) 45(-4.25,-1.25) 46(-4.25,-1.75) 47(-4.25,-2.25) 48(-4.25,-2.75)
MC-306_4P-L8.0-W3.2-P5.5-BL
  rect 0.9x1.3 smd: 1(-2.85,-1.5) 2(2.85,-1.5) 3(2.85,1.5) 4(-2.85,1.5)
MICRO-USB-SMD_U254-051T-4BH23-S2S
  rect 0.4x1.5 smd: 1(-1.3,1.3) 2(-0.65,1.3) 3(0,1.3) 4(0.65,1.3) 5(1.3,1.3)
  oval 1x1.7 hole 0.6x1.2: 6(-3.624,-1.45) 6(3.624,-1.45)
  oval 1.2x1 hole 0.7x0.6: 6(-2.425,1.45) 6(2.425,1.45)
OLED-TH_L35.4-W33.5_HS13L03W2C01
  round 1.6 hole 1: 1(-3.81,0) 2(-1.27,0) 3(1.27,0) 4(3.81,0)
Pad_e65
  round 4 hole 3: 1(0,0)
Pad_e67
  round 4 hole 3: 1(0,0)
Pad_e68
  round 4 hole 3: 1(0,0)
Pad_e69
  round 4 hole 3: 1(0,0)
Pad_e70
  oval 21x3 hole 20x2: 1(0,0)
Pad_e72
  oval 21x3 hole 20x2: 1(0,0)
QFN-24_L4.0-W4.0-P0.50-BL-EP2.7
  oval 0.28x0.8 smd: 1(-1.25,-2) 2(-0.75,-2) 3(-0.25,-2) 4(0.25,-2) 5(0.75,-2) 6(1.25,-2) 13(1.25,2) 14(0.75,2) 15(0.25,2) 16(-0.25,2) 17(-0.75,2) 18(-1.242,2)
  oval 0.8x0.28 smd: 7(2,-1.25) 8(2,-0.75) 9(2,-0.25) 10(2,0.25) 11(2,0.75) 12(2,1.25) 19(-2,1.25) 20(-2,0.75) 21(-2,0.25) 22(-2,-0.25) 23(-2,-0.75) 24(-2,-1.25)
  rect 2.7x2.7 smd: 25(0.013,0)
R0603
  rect 0.806x0.864 smd: 1(-0.753,0) 2(0.753,0)
SOD-123F_L2.8-W1.8-LS3.7-RD
  rect 1x1.2 smd: 1(-1.55,0) 2(1.55,0)
SOP-8_L4.9-W3.9-P1.27-LS6.0-TL-EP
  oval 1.6x0.6 smd: 1(-3,1.905) 2(-3,0.635) 3(-3,-0.635) 4(-3,-1.905) 5(3,-1.905) 6(3,-0.635) 7(3,0.635) 8(3,1.905)
  rect 3x3.5 smd: 9(0,0)
SOT-23-3_L2.9-W1.3-P1.90-LS2.4-BR
  rect 1.25x0.7 smd: 1(1,-0.95) 2(1,0.95) 3(-1,0)
SOT-23-3_L3.0-W1.7-P0.95-LS2.9-BR
  rect 1.038x0.532 smd: 1(1.101,-0.95) 2(1.101,0.95) 3(-1.101,0)
SOT-23-5_L3.0-W1.7-P0.95-LS2.8-BL
  rect 0.49x1.157 smd: 1(-0.95,-1.153) 2(0,-1.153) 3(0.95,-1.153)
  rect 0.49x1.175 smd: 4(0.95,1.153) 5(-0.95,1.153)
SW-SMD_L4.7-W3.5-P3.35-EH
  rect 0.8x1.4 smd: 1(-1.675,-0.917) 2(1.675,-0.917)
  rect 0.8x1.2 smd: 3(-2.25,0.917) 4(2.25,0.917)
SW-SMD_L6.0-W3.3-LS8.0
  rect 1.9x1.5 smd: 1(-4,0) 2(4,0)

## Nets
As in the schematic.

Pads without a net: LDO1 4; NOREF 1; NOREF#2 1; NOREF#3 1; NOREF#4 1; NOREF#5 1; NOREF#6 1; SW2 3 4; SW3 3 4; SW4 3 4; U1 2 11 12 13 15 17 18 27 29 30 31 32 33 38 39 40 41 42 43; U2 2 3 4 5 6 7 12 14 15 16 17 19 21 22; USB1 2 3; X2 2 3

## Via types
v1: diameter 0.61, hole 0.305, Top Layer to Bottom Layer, 101 vias

## Routing (per net, layer and track width the routed paths; a pad name or vN(x,y) marks a point on that pad's centre or on a via; arc(x,y) is an arc through that point)
3V3: length 118.9
  Top Layer w0.254: U2.8 26.16,26.54 25.81,26.54 25.46,26.2 25.15,26.2 24.19,27.15 v1(24.19,27.59) ; v1(23.88,23.85) 23.47,24.25 U1.36 ; U2.13 26.51,23.87 25.91,23.28 25.91,22.2 C12.1 26.16,21.56 v1(26.16,21.5) ; v1(20,15.28) 21.19,15.28 21.9,15.98 21.9,16.24 21.72,16.42 21.65,16.42 21.32,16.75 20.95,16.75 U1.24 ; 11.5,18.83 12.42,19.76 12.42,19.92 12.66,20.16 12.83,20.16 12.91,20.25 U1.9
  Top Layer w0.4: v1(27.21,18.32) 28.94,18.32 v1(28.96,18.3) ; C17.2 6.97,18.83 7.77,19.63 10.64,19.63 11.44,18.83 11.5,18.83 ; C17.2 C15.2 6.67,17.18 5.84,17.18 5.21,16.55 5.21,15.76 5.22,15.74 5.22,15 6.69,13.53 6.69,10.53 7.51,9.7 7.51,9.16 7.13,8.78 7.13,7.58 6.69,7.14 LED2.2 ; C17.2 6.29,18.83 LDO1.5 6.3,20.74 R1.2 6.87,22.77 7.88,23.78 H4.4 ; R3.2 R4.2 7.31,35.72 8.29,36.7 15.53,36.7 16.43,35.8 OLED1.2 ; R12.2 28.96,21.96 v1(28.92,22.01) ; U1.48 14.89,25.69 v1(14.35,25.69) ; R5.1 25.72,20.2 C12.1
  PWR w0.4: v1(24.19,27.59) 24.22,27.62 26.01,27.62 26.29,27.34 26.29,25.05 26.04,24.81 26.04,24.64 25.66,24.26 25.49,24.26 25.08,23.85 v1(23.88,23.85) ; v1(14.35,25.69) 14.35,27.34 v1(15.11,28.1) 16.43,29.42 16.43,30.68 15.98,31.13 15.98,31.68 16.43,32.13 OLED1.2 ; v1(14.35,25.69) 22.48,25.69 23.88,24.29 v1(23.88,23.85) ; v1(14.35,25.69) 14.35,21.38 v1(11.8,18.83) ; v1(23.88,23.85) 23.88,23.02 24.51,22.39 25.27,22.39 v1(26.16,21.5) 28.07,21.5 28.57,22.01 v1(28.92,22.01) 29.08,22.01 29.84,21.24 29.84,19.18 v1(28.96,18.3) ; 27.05,18.32 24,15.28 v1(20,15.28)
+5V: length 37
  Top Layer w0.254: U4.8 17.56,13.12 17.44,13.25 17.39,13.25 14.1,16.55 14.1,17.31 13.41,17.99 11.1,17.99 10.92,17.81 10.92,17.65 10.84,17.57 10.84,16.42 11.05,16.21 11.05,16.04 ; R20.2 9.39,16.04 11.05,16.04 ; 11.05,16.04 11.55,15.54 R21.2
  Top Layer w0.3: v1(9.53,9.81) 9.14,9.43 8.51,9.43 8.32,9.62 8.32,10.16 8.32,10.16 8.32,10.51 7.75,11.08 7.75,14.39 R20.2
  Top Layer w0.4: USB1.1 5.05,14.16 5.97,13.24 5.97,10.32 v1(6.86,9.43) ; U4.4 12.37,8.86 C20.1 9.97,9.81 v1(9.53,9.81)
  PWR w0.4: v1(6.86,9.43) 9.14,9.43 v1(9.53,9.81)
GND: length 52
  Top Layer w0.254: 14.73,20.86 14.62,20.75 U1.8 ; v1(18.03,18.58) 18.45,18.16 U1.20 ; LDO1.2 2.61,18.41 2.34,18.41 2.07,18.13 C14.1 ; USB1.6 1.27,16.69 C14.1 ; U2.25 29.49,27.14 U2.1 30.44,27.87 31,28.43 31.32,28.43 31.37,28.48 31.62,28.48 32.46,27.65 v1(32.46,26.58) ; U2.25 27.48,25.12 U2.11 ; U2.25 27.98,26.12 U2.9 ; C14.1 0.83,18.13 0.51,18.45 0.51,21.12 1.91,22.51 3.37,22.51 C16.1 ; U1.47 15.49,25.71 v1(15.49,24.42) 15.88,24.04 16.76,24.04 16.95,24.22 U1.44 ; C11.1 C10.1 ; v1(28,34.2) 28,34.7 27.05,35.65 25.71,35.65 25.53,35.47 25.53,35.28 C6.1 ; C4.2 22.98,23.35 22.98,23.42 22.65,23.75 U1.35 ; U1.23 v1(19.95,18.83)
  Top Layer w0.4: 4.37,10.44 4.37,11.41 USB1.5 USB1.4 ; OLED1.1 13.67,35.72 R2.2 11.24,34.64 C7.1
  vias: v1(8.04,16.93) v1(8.07,18.83) v1(9.78,8.8) v1(9.97,16.97) v1(10.09,20.74) v1(10.09,18.83) v1(10.13,6.83) v1(10.86,30.41) v1(11.38,10.24) v1(11.68,22.26) v1(12.04,8.11) v1(12.47,27.69) v1(12.82,13.12) v1(12.82,10.58) v1(14.99,20.99) v1(15.11,12.38) v1(15.13,10.08) v1(16.64,12.35) v1(16.59,10.08) v1(16.89,28.1) v1(17.24,14.91) v1(18.6,15.28) v1(20.51,7.15) v1(22.48,27.85) v1(23.37,22.46) v1(27.12,22.16) v1(27.31,8.54) v1(27.56,26.58) v1(27.98,24.93) v1(28.46,12.73) v1(29.18,26.07) v1(29.21,24.93) v1(29.59,23.66) v1(30.51,16.44) v1(32.58,19.08) v1(33.02,11.34) v1(33.73,24.42)
VBAT: length 48.4
  Top Layer w0.4: LDO1.1 3.11,19.85 C16.2 ; LDO1.1 2.79,19.53 C14.2 ; LDO1.1 3.75,19.78 4.19,19.34 4.19,18.32 3.75,17.88 v1(3.04,17.88)
  PWR w0.4: v1(29.84,11.3) 29.84,7.4 28.45,6 6.32,6 3.04,9.29 v1(3.04,17.88)
VBAT+: length 50.9
  Top Layer w0.4: R8.1 25.62,14.6 v1(25.62,12.73) ; v1(19.11,7.15) 20.25,6 22.1,6 23.79,7.7 23.79,8.92 23.71,8.84 v1(23.48,8.84)
  PWR w0.4: v1(30.99,9.18) 31.62,9.81 31.62,12.73 30.48,13.88 26.76,13.88 v1(25.62,12.73) 25.62,10.8 23.66,8.84 v1(23.48,8.84) ; v1(19.11,7.15) 19.11,8.74 v1(18.41,9.43) 16.13,11.72 v1(10.92,11.72) 10.92,24.42 12.45,25.94
  vias: v1(12.72,26.05)
ADC: length 24.4
  Top Layer w0.254: U1.10 13.54,19.84 14.24,19.84 14.25,19.85 v1(14.86,19.85) ; R15.2 R14.2 31.5,15.61 31.5,16.42 31.15,16.76 31.15,16.99 30.99,17.15 30.76,17.15 30.54,17.37 v1(22.72,17.37)
  Bottom Layer w0.254: v1(14.86,19.85) 15.18,19.53 15.18,18.48 16.28,17.37 v1(22.72,17.37)
BAT_ADC_EN: length 16.5
  Top Layer w0.254: U1.25 22.32,18.38 v1(23.37,18.38) ; v1(24.38,11.34) 24.15,11.34 Q3.1
  Bottom Layer w0.254: v1(24.38,11.34) 26.29,11.34 27.21,12.26 v1(27.21,12.73) 27.21,13.34 24.08,16.47 24.08,18.15 23.85,18.38 v1(23.37,18.38)
CTL: length 7.7
  Top Layer w0.254: U1.26 21.86,19.16 21.16,19.16 21.14,19.14 21.01,19.14 20.83,18.96 20.83,18.07 20.86,18.04 20.86,18.03 22.22,16.67 25.41,16.67 R10.1
I2C1_SCL: length 11.5
  Top Layer w0.254: U1.45 16.45,26.9 16.67,27.12 17.09,27.12 17.31,27.34 18.16,27.34 18.97,28.15 OLED1.3
I2C1_SDA: length 16
  Top Layer w0.254: U1.46 15.95,27.23 15.9,27.28 15.9,28.41 17.56,30.08 17.56,36.39 17.91,36.74 20.27,36.74 OLED1.4
I2C2_SCL: length 30.3
  Top Layer w0.254: v1(26.61,22.91) 29.95,22.91 30.47,22.4 R6.2 31.87,23.4 32.51,23.4 32.69,23.58 32.69,23.69 32.53,23.85 32.53,25.29 31.92,25.9 31.77,25.9 31.6,26.06 31.6,26.22 31.2,26.62 U2.23 ; v1(19.3,21.04) 16.59,21.04 16.43,21.19 15.95,21.19 15.61,20.85 15.61,20.37 15.7,20.28 15.7,19.72 16.12,19.3 17.25,19.3 17.34,19.21 18.42,19.21 18.95,18.68 18.95,17.95 18.95,17.95 U1.21
  Bottom Layer w0.254: v1(19.3,21.04) 24.73,21.04 v1(26.61,22.91)
I2C2_SDA: length 32
  Top Layer w0.254: v1(16.19,20.61) 16.19,19.94 16.3,19.83 16.37,19.83 16.42,19.88 18.76,19.88 19.3,19.34 19.3,18.1 19.36,18.04 19.36,17.34 U1.22 ; U2.24 30.52,27.12 v1(31.24,27.85)
  Bottom Layer w0.254: v1(16.19,20.61) 18.91,20.61 19.06,20.46 19.55,20.46 19.63,20.55 v1(27.24,20.55) 27.81,21.12 31.12,21.12 33.15,23.15 33.15,27.34 32.64,27.85 v1(31.24,27.85)
KEY1: length 31.7
  Top Layer w0.254: v1(25.39,26.97) 25.39,28.6 25.65,28.86 31.52,28.86 SW3.1 ; v1(25.66,18.32) 25.36,18.63 24.4,18.63 24.05,18.97 24.05,19.45 24.76,20.17 24.76,21.37 25.04,21.64 25.04,22.57 25.39,22.92 v1(25.39,24.91) ; U1.19 18.04,17.16 18.04,16.46 18.28,16.22 18.98,16.22 19.04,16.16 v1(21.08,16.16)
  Bottom Layer w0.254: v1(25.39,26.97) v1(25.39,24.91) ; 25.4,18.32 24.51,18.32 23.82,19.01 23.04,19.01 22.78,18.75 22.78,18.13 23.13,17.79 23.26,17.79 23.37,17.69 23.37,16.67 22.86,16.16 v1(21.08,16.16)
KEY2: length 19.2
  Top Layer w0.254: SW4.1 32.58,22.26 R12.1 29.53,19.21 v1(24.64,19.21) ; U1.16 16.45,18.26 16.64,18.45 16.76,18.45 v1(17.02,18.7)
  Bottom Layer w0.254: v1(17.02,18.7) 17.78,19.47 24.38,19.47 v1(24.64,19.21)
KEY3: length 32.7
  Top Layer w0.254: U1.14 15.54,17.34 15.54,18.04 15.89,18.39 v1(15.89,18.72)
  Bottom Layer w0.254: 30.35,18.2 29.09,16.93 v1(29.09,4.41) ; v1(30.47,18.3) 30.47,19.06 29.43,20.1 27.75,20.1 27.55,19.9 27.06,19.9 26.86,20.1 16.89,20.1 15.89,19.1 v1(15.89,18.72)
LED: length 36.9
  Top Layer w0.254: U1.28 20.68,20.25 20.19,20.74 20.19,24.29 20.86,24.96 20.86,27.5 22.99,29.63 22.99,36.61 22.35,37.25 7.87,37.25 LED4.2
NRST: length 11.9
  Top Layer w0.254: U1.7 13.36,21.16 12.66,21.16 12.24,20.74 11.5,20.74 10.61,21.62 9.26,21.62 R1.1
  Bottom Layer w0.254: 8.45,20.61 8.65,20.4 8.65,15.1 SW1.1
  vias: v1(8.41,20.74)
OSC32_IN: length 15.9
  Top Layer w0.254: U1.3 13.54,23.34 14.24,23.34 14.3,23.4 v1(15.11,23.4) ; v1(12.64,32.29) 14.83,32.29 X2.4
  Bottom Layer w0.254: v1(15.11,23.4) 15.88,23.4 16.26,23.78 16.26,25.05 12.83,28.48 12.83,32.1 v1(12.64,32.29)
OSC32_OUT: length 14.4
  Top Layer w0.254: U1.4 13.36,22.84 12.66,22.84 12.22,23.28 10.54,23.28 10.16,23.66 v1(10.03,23.66) ; C8.2 15.08,30.01 X2.1
  Bottom Layer w0.254: v1(10.03,23.66) 10.03,28.74 11.43,30.13 v1(12.24,30.13)
OSC_IN: length 23.6
  Top Layer w0.254: v1(28.45,30.67) 29.4,31.63 C5.2 ; v1(19.05,24.42) 18.41,24.42 16.33,22.34 13.54,22.34 U1.5
  Bottom Layer w0.254: v1(28.45,30.67) 26.32,30.67 23.24,27.59 23.24,25.56 22.1,24.42 v1(19.05,24.42)
OSC_OUT: length 33.9
  Top Layer w0.254: v1(24.75,31.02) 25.85,32.12 C6.2 ; v1(17.78,22.51) 17.02,21.75 U1.6
  Bottom Layer w0.254: v1(17.78,22.51) 18.29,22.51 18.92,21.88 23.88,21.88 30.86,28.86 30.86,31.28 29.97,32.17 25.89,32.17 v1(24.75,31.02)
SWCLK: length 20.4
  Top Layer w0.254: R2.1 8.64,31.67 H4.1 v1(16.64,31.4) ; U1.37 20.36,25.84 20.36,26.79 20.19,26.96 v1(20.19,28.1)
  Bottom Layer w0.254: v1(16.64,31.4) 17.4,31.4 20.19,28.61 v1(20.19,28.1)
SWDIO: length 23.5
  Top Layer w0.254: v1(13.97,28.86) H4.2 7.11,28.86 5.47,30.51 R3.1 ; v1(20.83,23.28) 21.92,23.28 U1.34
  Bottom Layer w0.254: v1(20.83,23.28) 18.54,23.28 13.97,27.84 v1(13.97,28.86)
$1N2127: length 4.1
  Top Layer w0.254: LED4.1 5.47,37.11 R4.1
$1N2723: length 1.8
  Top Layer w0.254: U2.10 26.18,25.69 24.52,25.69
$1N2897: length 1.9
  Top Layer w0.254: C13.1 31.11,25.12 U2.20
$1N4359: length 11.9
  Top Layer w0.254: D2.1 D1.1 30.1,8.57 30.1,9.94 31.5,11.34 31.5,13.84 SW2.1
$1N4372: length 16.2
  Top Layer w0.254: D2.2 24.38,6.11 24.38,10.07 25.38,11.07 Q2.3 ; Q2.3 26.92,11.07 Q1.1 ; Q2.3 26.16,12 26.34,12.19 26.34,13.28 26.16,13.47 26.16,13.63 R8.2
$1N4677: length 11
  Top Layer w0.254: R9.2 28.94,16.42 v1(27.17,16.42)
  Bottom Layer w0.254: v1(25.21,9.07) 26.05,9.07 27.81,10.83 27.81,15.78 27.18,16.42
$1N5591: length 6
  Top Layer w0.254: LED2.1 8.29,5.37 8.67,4.99 11.3,4.99 11.48,5.17 11.48,6.32 R13.2
$1N5674: length 10.3
  Top Layer w0.254: Q3.3 24.51,12.95 24.51,15.4 24.69,15.58 28.4,15.58 28.96,15.01 R14.1
$1N5975: length 9.8
  Top Layer w0.254: R18.1 11.22,27.82 R17.1 10.29,27.85 10.03,27.59 10.03,24.67 10.73,23.98 C18.1 11.51,24.25 U1.1
$1N6421: length 8.3
  Top Layer w0.254: U4.2 12,11.85 11.38,12.48 11.38,13.44 11.56,13.62 12,13.62 12.08,13.7 12.27,13.7 12.95,14.39 12.95,16.42 12.4,16.97 R19.2
$1N6590: length 14.2
  Top Layer w0.254: U4.7 v1(20.19,11.85)
  Bottom Layer w0.254: 15.11,4.48 16.38,4.48 17.27,5.37 20.07,5.37 21.34,6.64 21.34,10.71 v1(20.19,11.85)
  vias: v1(14.95,4.6)
$1N6593: length 18.4
  Top Layer w0.254: R20.1 6.87,14.77 7.24,14.39 7.24,10.7 7.94,10 7.94,8.09 8.51,7.53 14.99,7.53 16.26,6.26 16.26,4.65 16.29,4.61 LED3.2
$1N6685: length 22
  Top Layer w0.254: v1(8.93,10.68) 8.93,12.64 10.04,13.76 R21.1
  Bottom Layer w0.254: v1(8.93,10.68) 8.93,6.22 11.17,3.98 20.07,3.98 20.57,4.48
  vias: v1(20.54,4.7)
$1N6689: length 9.4
  Top Layer w0.254: U5.1 18.78,4.63 17.4,6 17.4,7.4 18.29,8.29 18.67,8.29 19.11,8.74 19.56,8.74 19.9,9.07 19.9,9.52 20.19,9.81 20.19,10.07 19.69,10.58 18.83,10.58 U4.6

## Copper pours and planes (outline as drawn; the poured copper is in the pictures)
GND on GND: 0.26,41.24 35.14,41.24 35.14,0.26 0.26,0.26

Small or netless copper shapes (teardrops, artwork), in the pictures only: 21 on GND

## Text on the board
Bottom Silkscreen Layer: 火禾实验室
Top Silkscreen Layer: CLK | GND | 3V3 | DIO
